# Altium schematic sheet Power.SchDoc
size A
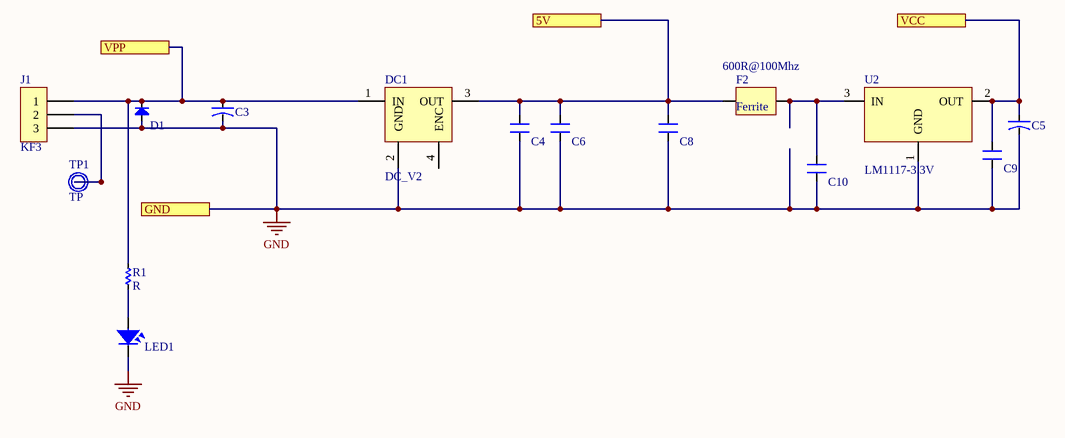
[diagram p0: Power.SchDoc]

## Parts
C3  CN-ALU-SMD  [CAP-ALU-SMD-F]  (value not drawn)
C4  CN  [CN-SMD-0603_big]  (value not drawn)
C5  CN-ALU-SMD  [CAP-ALU-SMD-F]  (value not drawn)
C6  CN  [CN-SMD-0603_big]  (value not drawn)
C8  CN  [CN-SMD-0603_big]  (value not drawn)
C9  CN  [CN-SMD-0603_big]  (value not drawn)
C10  CN  [CN-SMD-0603_big]  (value not drawn)
D1  Diode  [DIO-SMD-106-HayDung]  (value not drawn)
DC1  DC_V2  [DC_V2]
F2  600R@100Mhz  [Capacitor_805]
J1  KF3  [KF3-5.08T]
LED1  LED  [LED-0805-Red]  (value not drawn)
R1  R  [RES-SMD-0603_BIG]
TP1  TP  [TP1]
U2  LM1117-3.3V  [SOT223]

## Ports
5V, GND, VCC, VPP

## Nets
GND: C3.2 C4.1 C5.2 C6.1 C8.1 C9.1 C10.1 D1.1(A) DC1.2(GND) J1.3 LED1.2 U2.1(GND) ; port GND
5V: C4.2 C6.2 C8.2 DC1.3(OUT) F2.1 ; port 5V
VCC: C5.1 C9.2 U2.2(OUT) ; port VCC
VPP: C3.1 D1.2(K) DC1.1(IN) J1.1 R1.1 ; port VPP
NetC10_2: C10.2 F2.2 U2.3(IN)
NetJ1_2: J1.2 TP1.1
NetLED1_1: LED1.1 R1.2

Not connected (* = marked no-connect by the designer): DC1 4(ENC)

## Library data of the parts
C3 C5 = CN-ALU-SMD: Polarized Capacitor (Axial); Published: 8-Jun-2000; LatestRevisionDate: 17-Jul-2002; LatestRevisionNote: Re-released for DXP Platform.; PackageReference: POLAR0.8; Publisher: Altium Limited
C4 C6 C8-C10 = CN: Value: 33pF
D1 = Diode: Default Diode; Code - JEDEC: DO-214-AB; Value: 1N5007; Published: 8-Jun-2000; Revision: July-2002: Re-released for DXP Platform.; Publisher: Altium Limited; ComponentLink1Description: ES1J - STMBL; ComponentLink1URL: https://banlinhkien.vn/goods-8089-es1j-do214-diode-1a-600v-sma-es1j-.html
DC1 = DC_Module_V2
F2 = Ferrite
J1 = KF3: Manufacturer: Würth Elektronik eiSos GmbH; partNo: 691103110003; ComponentLink1 Description: Manufacturer; ComponentLink2 Description: Datasheet; NoPins: 3; Created Date: 29 October 2013; ComponentLink1URL: http://www.we-online.com; ComponentLink2URL: http://katalog.we-online.de/em/datasheet/6911031100xx.pdf; Created by: Karrer Zheng
LED1 = LED SMD: Value: LED 3 - 5 ly 2 Colour
TP1 = TP1: Test Point; Value: Test Point
U2 = LM1117: 800mA Low-Dropout Linear Regulator; Creator: Nguyen Ba Bien; Website: http://group3i.net